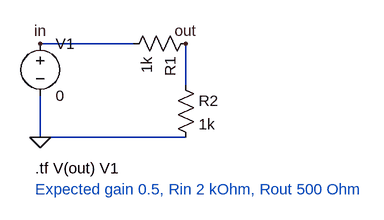
[diagram p0: schematic 06_tf_voltage_divider.asc]
06_tf_voltage_divider.asc, the LTspice schematic file:
Version 4
SHEET 1 880 680
WIRE 80 96 224 96
WIRE 304 96 304 160
WIRE 80 176 80 240
WIRE 80 240 304 240
FLAG 80 240 0
FLAG 80 96 in
FLAG 304 96 out
SYMBOL voltage 80 80 R0
SYMATTR InstName V1
SYMATTR Value 0
SYMBOL res 320 80 R90
SYMATTR InstName R1
SYMATTR Value 1k
SYMBOL res 288 144 R0
SYMATTR InstName R2
SYMATTR Value 1k
TEXT 72 288 Left 2 !.tf V(out) V1
TEXT 72 320 Left 2 ;Expected gain 0.5, Rin 2 kOhm, Rout 500 Ohm

The netlist it stands for:
* 06_tf_voltage_divider.asc
V1 in 0 0
R1 out in 1k
R2 out 0 1k
.tf V(out) V1
* Expected gain 0.5, Rin 2 kOhm, Rout 500 Ohm
.backanno
.end